# EAGLE design SkyKontrol-IotController (EAGLE 9.5.2)
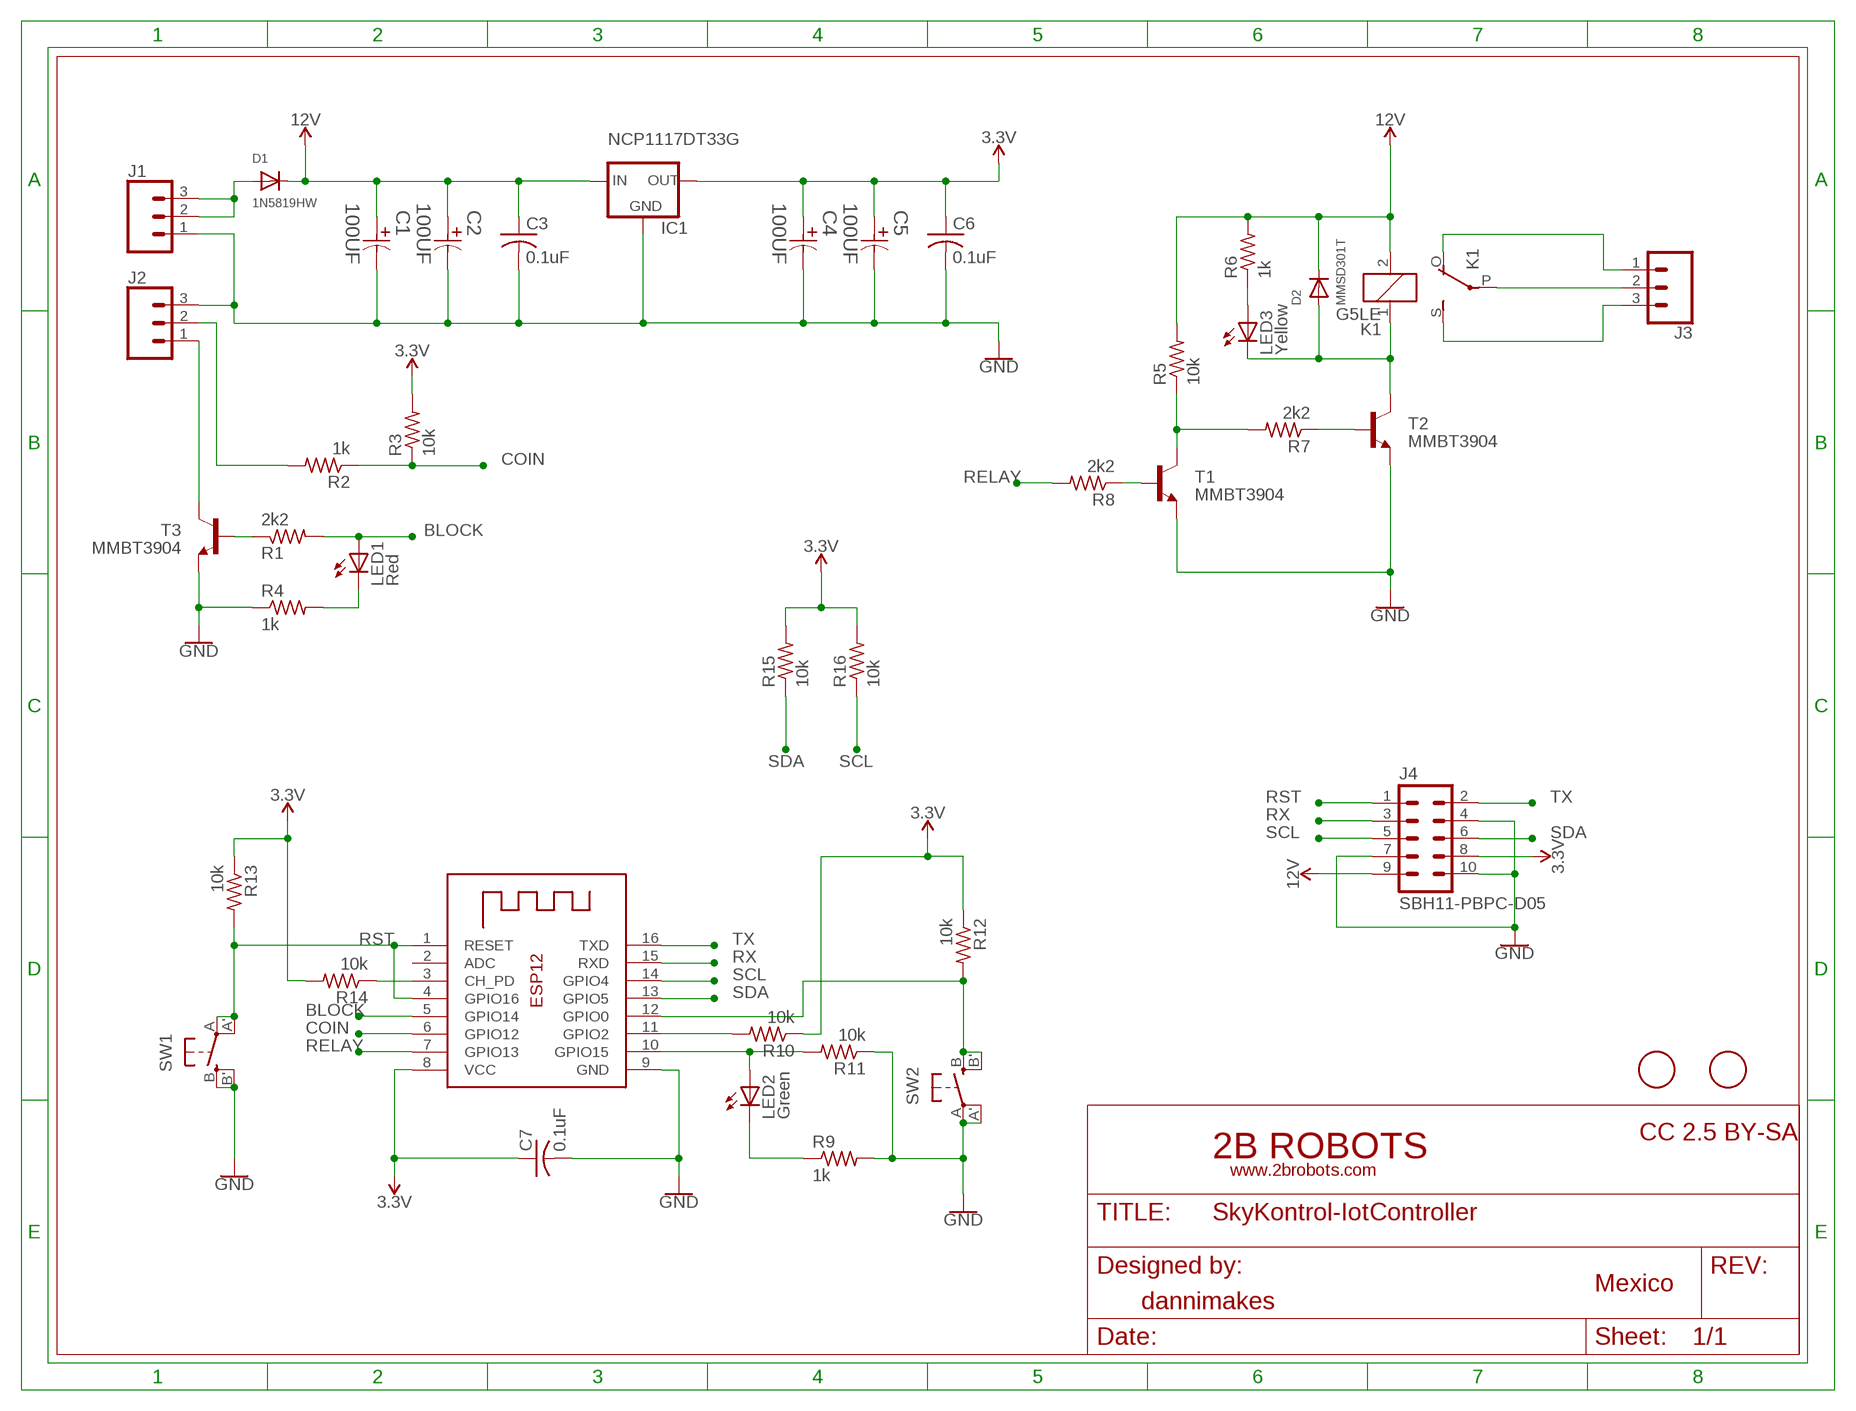
[diagram p0: schematic, sheet 1]

## Parts
C1  100UF  EEE-HA1E101XP-CASE-D8  [CAPAE660X800N]
C2  100UF  EEE-HA1E101XP-CASE-D8  [CAPAE660X800N]
C3  0.1uF  C-USC0603K  [C0603K]
C4  100UF  EEE-HA1E101XP-CASE-D8  [CAPAE660X800N]
C5  100UF  EEE-HA1E101XP-CASE-D8  [CAPAE660X800N]
C6  0.1uF  C-USC0603K  [C0603K]
C7  0.1uF  C-USC0603K  [C0603K]
D1  1N5819HW  DIODESOD-123  [SOD-123]
D2  MMSD301T  DIODESOD-123  [SOD-123]
IC1  NCP1117DT33G  LM1117TO252  [TO252]
J1  CONN_03-SCREW-5MM  [SCREWTERMINAL-5MM-3]
J2  CONN_03-SCREW-5MM  [SCREWTERMINAL-5MM-3]
J3  CONN_03-SCREW-5MM  [SCREWTERMINAL-5MM-3]
J4  SBH11-PBPC-D05  [SBH11-PBPC-D05]
K1  G5LE  [G5LE]
LED1  Red  LEDCHIPLED_1206  [CHIPLED_1206]
LED2  Green  LEDCHIPLED_1206  [CHIPLED_1206]
LED3  Yellow  LEDCHIPLED_1206  [CHIPLED_1206]
R1  2k2  R-US_R0805  [R0805]
R2  1k  R-US_R0805  [R0805]
R3  10k  R-US_R0805  [R0805]
R4  1k  R-US_R0805  [R0805]
R5  10k  R-US_R0805  [R0805]
R6  1k  R-US_R0805  [R0805]
R7  2k2  R-US_R0805  [R0805]
R8  2k2  R-US_R0805  [R0805]
R9  1k  R-US_R0805  [R0805]
R10  10k  R-US_R0805  [R0805]
R11  10k  R-US_R0805  [R0805]
R12  10k  R-US_R0805  [R0805]
R13  10k  R-US_R0805  [R0805]
R14  10k  R-US_R0805  [R0805]
R15  10k  R-US_R0805  [R0805]
R16  10k  R-US_R0805  [R0805]
SW1  SPST_TACT-EVQQ2  [EVQ-Q2]
SW2  SPST_TACT-EVQQ2  [EVQ-Q2]
T1  MMBT3904  MMBT3904LT1-NPN-SOT23-BEC  [SOT23-BEC]
T2  MMBT3904  MMBT3904LT1-NPN-SOT23-BEC  [SOT23-BEC]
T3  MMBT3904  MMBT3904LT1-NPN-SOT23-BEC  [SOT23-BEC]
U$1  FIDUCIAL  [FIDUCIAL_1MM]
U$2  FIDUCIAL  [FIDUCIAL_1MM]
X1  ESP-12  [ESP-12]

## Nets
3.3V: C4.1 C5.1 C6.1 C7.1 IC1.3(OUT) J4.8 R3.2 R10.1 R12.1 R13.1 R14.2 R15.2 R16.2 X1.8(VCC)
12V: C1.1 C2.1 C3.1 D1.C D2.C IC1.2(IN) J4.9 K1.2 R5.2 R6.2
BLOCK: LED1.A R1.2 X1.5(GPIO14)
COIN: R2.1 R3.1 X1.6(GPIO12)
GND: C1.2 C2.2 C3.2 C4.2 C5.2 C6.2 C7.2 IC1.1(GND) J1.1 J2.3 J4.4 J4.7 J4.10 R4.1 R9.2 R11.1 SW1.B'(S1) SW1.B(S) SW2.A'(P1) SW2.A(P) T1.E T2.E T3.E X1.9(GND)
N$1: LED1.C R4.2
N$5: J3.2 K1.P(2:P)
N$6: J2.1 T3.C
N$7: J3.3 K1.S(2:S)
N$8: J3.1 K1.O(2:O)
N$9: D2.A K1.1 LED3.C T2.C
N$12: J2.2 R2.2
N$13: LED3.A R6.1
N$14: R7.1 T2.B
N$15: R5.1 R7.2 T1.C
N$16: R8.1 T1.B
N$17: R1.1 T3.B
N$18: R14.1 X1.3(CH_PD)
N$19: R12.2 SW2.B'(S1) SW2.B(S) X1.12(GPIO0)
N$20: D1.A J1.2 J1.3
N$21: LED2.C R9.1
N$22: LED2.A R11.2 X1.10(GPIO15)
N$23: R10.2 X1.11(GPIO2)
RELAY: R8.2 X1.7(GPIO13)
RST: J4.1 R13.2 SW1.A'(P1) SW1.A(P) X1.1(RESET) X1.4(GPIO16)
RX: J4.3 X1.15(RXD)
SCL: J4.5 R16.1 X1.14(GPIO4)
SDA: J4.6 R15.1 X1.13(GPIO5)
TX: J4.2 X1.16(TXD)
Unconnected: X1.2(ADC)

## Library data of the parts
C1 C2 C4 C5 = Panasonic-EEEFT_EEEH:EEE-: Aluminum Electrolytic Capacitors,Surface Mount Type; MPN: EEE-HA1E101XP; OC_FARNELL: 1973328; OC_NEWARK: 58T9236; PACKAGE: CASE-D8; SUPPLIER: PANASONIC; TOLERANCE: ±20 %; VOLTAGERATING: 25V
C3 C6 C7 = adafruit:C-US: CAPACITOR, American symbol
D1 D2 = adafruit:DIODE: Diode SMADIODE - SMA Surface Mount Package 20V 1A Schottky Diode Digikey: 641-1014-6-ND DO-1N4148 - Through Hole Small Current Diode SOD-123 20V 1 A (.5mV Vf) Schottky Diode - Digikey: MBRX120TPMSCT-ND SOD-323 10V 570mA (.38mV Vf, 3ns) Schottky Diode - Digikey: ZLLS410CT-ND SOD-523 30V 30mA Schottky Diode (RB751S-40TE61) - Digikey: RB751S-40TE61CT-ND SOT23-R/W - SOT23 Package (R = Solder Paste/Reflow Ovens, W = Hand-Soldering) BAT54Film 40V 300mA - Digikey: 497-7162-1-ND
IC1 = v-reg-3:LM1117
J1-J3 = SparkFun-Connectors:CONN_03: Multi connection point. Often used as Generic Header-pin footprint for 0.1 inch spaced/style header connections On any of the 0.1 inch spaced packages, you can populate with these: Break Away Headers - Straight <https://www.sparkfun.com/products/116> (PRT-00116) Break Away Male Headers - Right Angle <https://www.sparkfun.com/products/553> (PRT-00553) Female Headers <https://www.sparkfun.com/products/115> (PRT-00115) Break Away Headers - Machine Pin <https://www.sparkfun.com/products/117> (PRT-00117) Break Away Female Headers - Swiss Machine Pin <https://www.sparkfun.com/products/743> (PRT-00743) Stackable Header - 3 Pin (Female, 0.1") <https://www.sparkfun.com/products/13875> (PRT-13875) For SCREWTERMINALS and SPRING TERMINALS visit here: Screw Terimnals on SparkFun.com <https://www.sparkfun.com/search/results?term=Screw+Terminals> (5mm/3.5mm/2.54mm spacing) This device is also useful as a general connection point to wire up your design to another part of your project. Our various solder wires solder well into these plated through hole pads. Hook-Up Wire - Assortment (Stranded, 22 AWG) <https://www.sparkfun.com/products/11375> (PRT-11375) Hook-Up Wire - Assortment (Solid Core, 22 AWG) <https://www.sparkfun.com/products/11367> (PRT-11367) View the entire wire category on our website here <https://www.sparkfun.com/categories/141> Special notes: Molex polarized connector foot print use with SKU : PRT-08232 with associated crimp pins and housings.; PROD_ID: CONN-10134; SF_SKU: PRT-08433
J4 = con-sullins:SBH11-PBPC-D05: HEADER - Vertical, Shrouded
K1 = relay:G5LE: RELAY 1 x switch, 10 A/120 V AC, 8 A/30 V DC, Omron; OC_FARNELL: unknown; OC_NEWARK: unknown
LED1-LED3 = adafruit:LED: LED OSRAM: - CHIPLED LG R971, LG N971, LY N971, LG Q971, LY Q971, LO R971, LY R971 LH N974, LH R974 LS Q976, LO Q976, LY Q976 LO Q996 - Hyper CHIPLED LW Q18S LB Q993, LB Q99A, LB R99A - SideLED LS A670, LO A670, LY A670, LG A670, LP A670 LB A673, LV A673, LT A673, LW A673 LH A674 LY A675 LS A676, LA A676, LO A676, LY A676, LW A676 LS A679, LY A679, LG A679 - Hyper Micro SIDELED® LS Y876, LA Y876, LO Y876, LY Y876 LT Y87S - SmartLED LW L88C, LW L88S LB L89C, LB L89S, LG L890 LS L89K, LO L89K, LY L89K LS L896, LA L896, LO L896, LY L896 - TOPLED LS T670, LO T670, LY T670, LG T670, LP T670 LSG T670, LSP T670, LSY T670, LOP T670, LYG T670 LG T671, LOG T671, LSG T671 LB T673, LV T673, LT T673, LW T673 LH T674 LS T676, LA T676, LO T676, LY T676, LB T676, LH T676, LSB T676, LW T676 LB T67C, LV T67C, LT T67C, LS T67K, LO T67K, LY T67K, LW E67C LS E67B, LA E67B, LO E67B, LY E67B, LB E67C, LV E67C, LT E67C LW T67C LS T679, LY T679, LG T679 LS T770, LO T770, LY T770, LG T770, LP T770 LB T773, LV T773, LT T773, LW T773 LH T774 LS E675, LA E675, LY E675, LS T675 LS T776, LA T776, LO T776, LY T776, LB T776 LHGB T686 LT T68C, LB T68C - Hyper Mini TOPLED® LB M676 - Mini TOPLED Santana® LG M470 LS M47K, LO M47K, LY M47K Source: http://www.osram.convergy.de/
R1-R16 = adafruit:R-US_: RESISTOR, American symbol
SW1 SW2 = adafruit:SPST_TACT: SMT 6mm switch, EVQQ2 series http://www.ladyada.net/library/eagle
T1-T3 = transistor:*-NPN-: NPN Transistror BF959 corrected 2008.03.06
U$1 U$2 = adafruit:FIDUCIAL: For use by pick and place machines to calibrate the vision/machine, 1mm By microbuilder.eu
X1 = adafruit:ESP-12

## Board
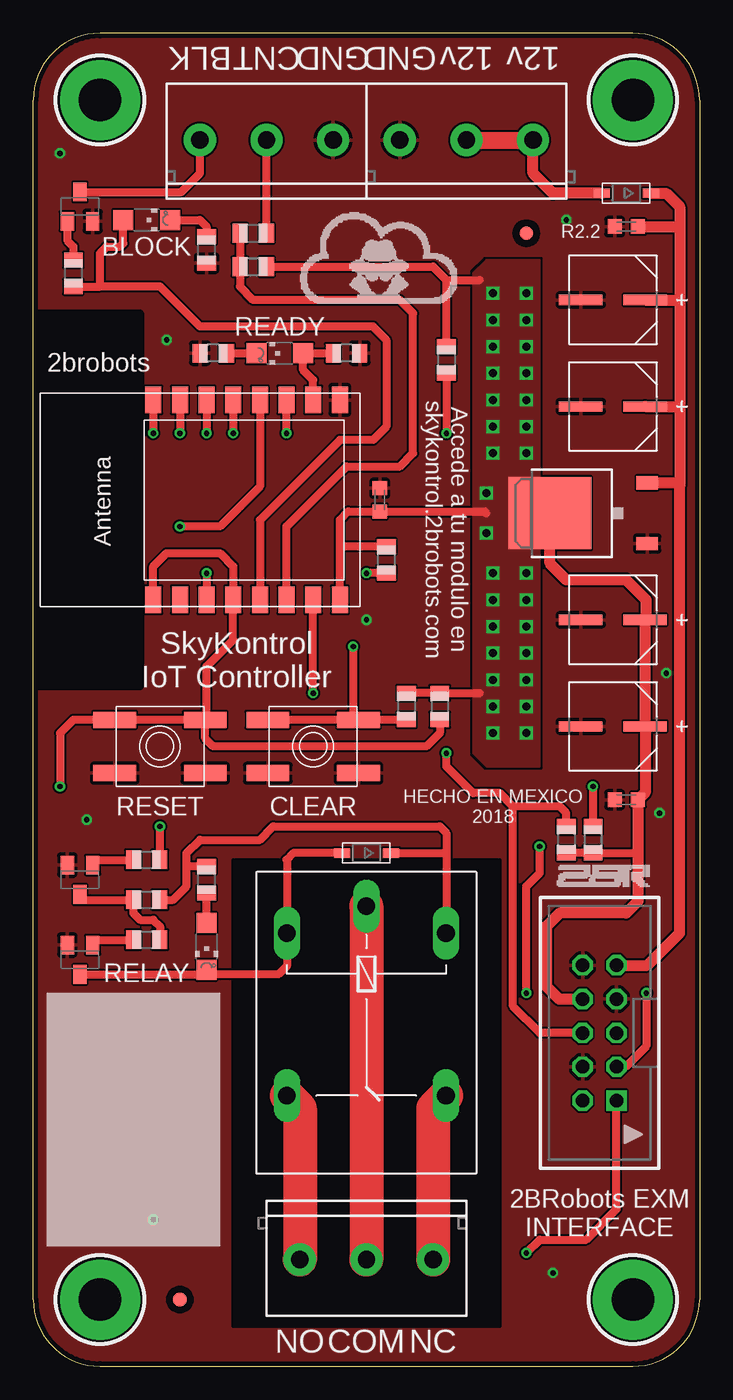
[diagram p1: board, top side]
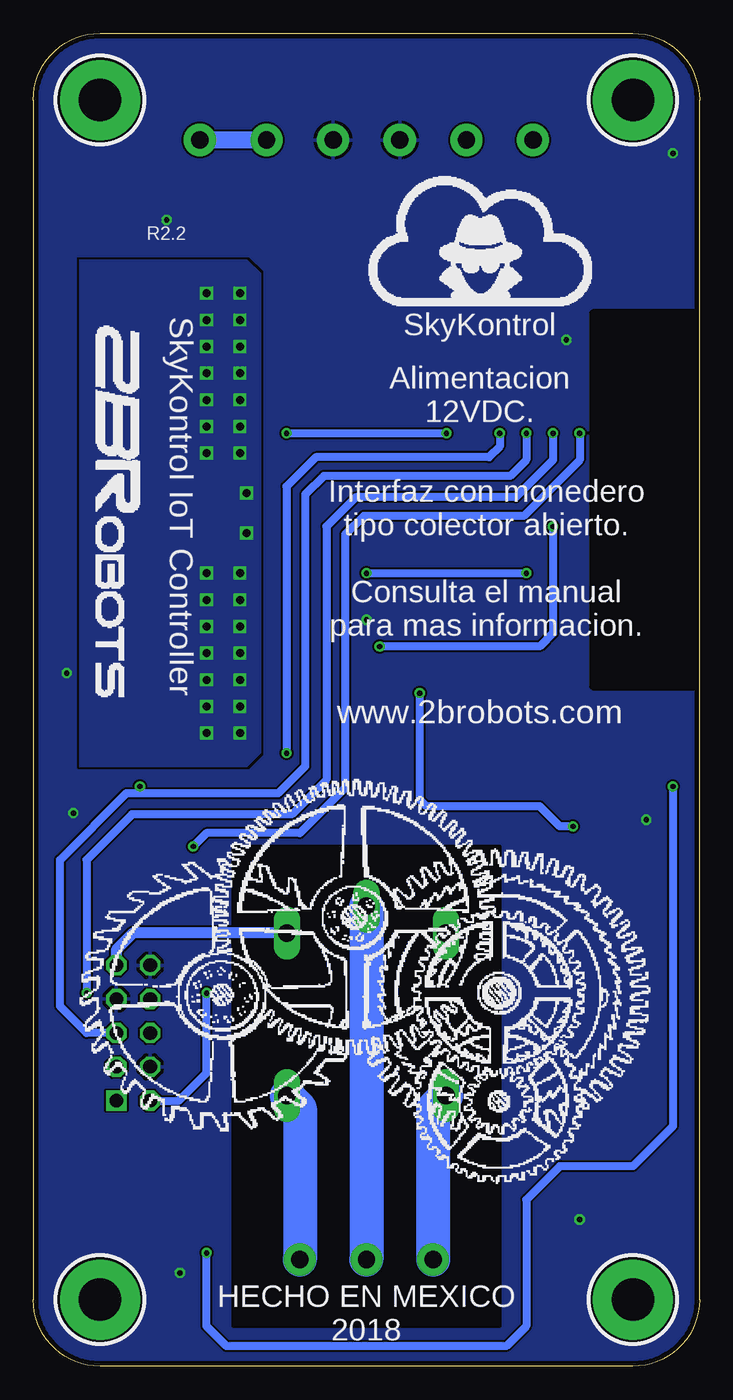
[diagram p2: board, bottom side, seen from below]

Size 50 x 100 mm. Coordinates in mm from the lower left corner, seen from the top.
Outline: 5,0 45,0 arc90 50,5 50,95 arc90 45,100 5,100 arc90 0,95 0,5 arc90 5,0
Copper layers (1*16): Top 0.0356mm / dielectric 1.5011mm / Bottom 0.0356mm
Design rules "2brobots-2layer": minimum track width 6mil, minimum drill 0.3mm, track to track 6mil, track to pad 6mil, pad to pad 6mil, via to via 6mil, smd to smd 6mil, copper to edge 15mil, drill to drill 6mil, minimum pad ring 7mil, minimum via ring 7mil, stop-mask expansion 2.5mil, vias tented up to drill 50mil, thermal gap 10mil
tRestrict: area 0,51 to 8,79; area 15,3 to 35,38
bRestrict: area 0,51 to 8,79; area 15,3 to 35,39

### Footprints (pad centres in the part's own frame; a part is rotated, then mirrored left to right if it is on the bottom)
CAPAE660X800N = smd 3.251 x 0.762: 1 -2.413,0; 2 2.413,0
C0603K = smd 1.05 x 1.08: 1 -0.875,0; 2 0.875,0
SOD-123 = smd 1.2 x 0.7: A 1.85,0; C -1.85,0
TO252 = smd 1 x 1.6: 1 -2.28,-6.07; 2 2.28,-6.07 | smd 5.4 x 6.2: 3 0,1.23
SCREWTERMINAL-5MM-3 = drill 1.3 pad 2.413: 1 -5,0; 2 0,0; 3 5,0
SBH11-PBPC-D05 = drill 1.016 square: 1 -5.08,-1.27 | drill 1.016 octagon: 2 -5.08,1.27; 3 -2.54,-1.27; 4 -2.54,1.27; 5 0,-1.27; 6 0,1.27; 7 2.54,-1.27; 8 2.54,1.27; 9 5.08,-1.27; 10 5.08,1.27
G5LE = drill 1.321 long: 1 -7.493,-5.969; 2 -7.493,5.969; O 4.699,5.969; P -9.525,0; S 4.699,-5.969
CHIPLED_1206 = smd 1.5 x 1.5: A 0,-1.75; C 0,1.75
R0805 = smd 1.1 x 1.4: 1 -1,0; 2 1,0
EVQ-Q2 = smd 3.2 x 1.2: A -3.4,-2; A' 3.4,-2; B -3.4,2; B' 3.4,2
SOT23-BEC = smd 1 x 1.4: B -0.95,-1.1; C 0,1.1; E 0.95,-1.1
FIDUCIAL_1MM = smd 1 x 1: 1 0,0
ESP-12 = smd 2 x 1.2: 1 -7.5,4.5; 2 -7.5,2.5; 3 -7.5,0.5; 4 -7.5,-1.5; 5 -7.5,-3.5; 6 -7.5,-5.5; 7 -7.5,-7.5; 8 -7.5,-9.5; 9 7.5,-9.5; 10 7.5,-7.5; 11 7.5,-5.5; 12 7.5,-3.5; 13 7.5,-1.5; 14 7.5,0.5; 15 7.5,2.5; 16 7.5,4.5

### Placement (x,y rotation side)
C1  43.5,80 180 top
C2  43.5,72 180 top
C3  44.5,85.5 180 top
C4  43.5,56 180 top
C5  43.5,48 180 top
C6  44.5,42.5 180 top
C7  26,65 90 top
D1  44.5,88 180 top
D2  25,38.5 180 top
IC1  40,64 90 top
J1  32.5,92 0 top
J2  17.5,92 0 top
J3  25,8 180 top
J4  42.5,25 90 top
K1  25,25 270 top
LED1  8.5,86 270 top
LED2  18.5,76 90 top
LED3  13,31.5 180 top
R1  3,82 270 top
R2  16.5,85 0 top
R3  16.5,82.5 0 top
R4  13,83.75 90 top
R5  8.5,35 0 top
R6  13,36.5 90 top
R7  8.5,32 0 top
R8  8.5,38 0 top
R9  13.5,76 180 top
R10  31,75.5 270 top
R11  23.5,76 180 top
R12  28,49.5 270 top
R13  30.5,49.5 270 top
R14  26.5,60.5 90 top
R15  40,39.5 270 top
R16  42,39.5 270 top
SW1  9.5,46.5 180 top
SW2  21,46.5 0 top
T1  3.5,36.5 180 top
T2  3.5,30.5 180 top
T3  3.5,87 0 top
U$1  11,5 0 top
U$2  37,85 0 top
X1  13.5,65 90 top

### Tracks (layer width: path | path; a pad name or v marks a point on that pad's centre or on a via)
3.3V  (via drill 0.6)
  Top 0.61: C5.1 46,47.91 | C4.1 46,56.09 | X1.8 23,61.5 | 23,61.5 23,63.5 23.62,64.12 C7.1 33.88,64.12 34,64 | 31,81.5 30,82.5 R3.2 | 31,81.5 33.5,81.5 | R10.1 31,81.5 | R14.2 23,61.5 | R12.1 R13.1 33.5,50.5 | R15.2 R16.2 45.38,38.5
  Top 0.813: C4.1 C5.1 45.91,43.04 C6.1 45.38,38.5 45.38,34.88 44.5,34 39.5,34 38.5,33 38.5,28.5 39.46,27.54 J4.8 | 46,56.09 46,57.5 44.5,59 40,59 38.77,60.23 IC1.3
  other vias: 34.5,59.5 37,59.5 34.5,57.5 37,57.5 34.5,55.5 37,55.5 34.5,53.5 37,53.5 34.5,51.5 37,51.5 34.5,49.5 37,49.5 34.5,47.5 37,47.5 34.5,80.5 37,80.5 34.5,78.5 37,78.5 34.5,76.5 37,76.5 34.5,74.5 37,74.5 34.5,72.5 37,72.5 34.5,70.5 37,70.5 34.5,68.5 37,68.5 34,62.5 34,65.5
  pour Top (isolate 0.406, no thermals): 38,45 38,83 34,83 33,82 33,46 34,45
  pour Bottom (isolate 0.406, no thermals): 46.5,83 34,83 33,82 33,46 34,45 46.5,45
12V
  Top 0.61: 48.22,66.28 48.5,66 | R5.2 10.5,35 11.5,36 11.5,37.5 | 11.5,37.5 11.5,38.5 12.5,39.5 17,39.5 18,40.5 30.5,40.5 31,40 31,38.5 | 31,38.5 31,32.52 K1.2 | D2.C 31,38.5 | R6.2 11.5,37.5
  Top 0.813: D1.C 47.5,88 48.5,87 48.5,85.5 | 48.5,85.5 48.5,80 | 48.5,80 48.5,72 | 48.5,72 48.5,66 48.5,32.5 46.08,30.08 J4.9 | C3.1 48.5,85.5 | C1.1 48.5,80 | C2.1 48.5,72 | IC1.2 48.22,66.28
  Bottom 0.813: K1.2 42.51,32.49 43.77,31.23 J4.9
BLOCK
  Top 0.61: R1.2 5,81 | 5,81 5,83.5 5.5,84 6.5,84 6.75,84.25 LED1.A | X1.5 17,63.5 23,69.5 25.5,69.5 26.5,70.5 26.5,77 25.5,78 12.5,78 9.5,81 5,81
COIN
  Top 0.61: R2.1 R3.1 15.5,81 16.5,80 27.5,80 28.5,79 28.5,68.5 27.5,67.5 23.5,67.5 19,63 X1.6
GND  (via drill 0.4)
  other vias: 47,41.5 47.5,52 4,41 9,11 39,7 40,86 2,91 25,56 10,77
  pour Top (rank 2): 0,100 50,100 50,0 0,0
  pour Bottom (rank 2): 0,100 50,100 50,0 0,0
N$1
  Top 0.61: LED1.C 12.5,86 13,85.5 R4.2
N$2  (via drill 3.2 pad 6)
  other vias: 5,95
N$4  (via drill 3.2 pad 6)
  other vias: 45,95
N$5
  Top 2.54: K1.P J3.2
  Bottom 2.54: K1.P J3.2
N$6
  Top 0.61: T3.C 11.1,88.1 12.5,89.5 J2.1
N$7
  Top 2.54: K1.S 20,19.33 J3.3
  Bottom 2.54: K1.S 20,19.33 J3.3
N$8
  Top 2.54: K1.O 30,19.33 J3.1
  Bottom 2.54: K1.O 30,19.33 J3.1
N$9
  Top 0.61: D2.A 19.5,38.5 19,38 19.03,37.97 K1.1 19.03,30.03 18.4,29.4 12.65,29.4 | T2.C 12.65,29.4 | 12.65,29.4 LED3.C
N$10  (via drill 3.2 pad 6)
  other vias: 5,5
N$11  (via drill 3.2 pad 6)
  other vias: 45,5
N$12
  Top 0.61: R2.2 J2.2
N$13
  Top 0.61: LED3.A R6.1
N$14
  Top 0.61: T2.B 4.85,32 R7.1
N$15
  Top 0.61: T1.C 3.9,35 R5.1 7.5,34 8,33.5 9,33.5 9.5,33 R7.2
N$16
  Top 0.61: T1.B 4.85,38 R8.1
N$17
  Top 0.61: T3.B 2.55,84.45 3,84 R1.1
N$18  (via drill 0.4)
  Top 0.61: R14.1 v25,59.5 | v13,59.5 X1.3
  Bottom 0.61: v25,59.5 v13,59.5
N$19  (via drill 0.4)
  Top 0.61: 24,48.5 SW2.B' R12.2 | 24,48.5 SW2.B | X1.12 17,66 14,63 v11,63 | v24,54 24,48.5
  Bottom 0.61: v24,54 12,54 11,55 v11,63
N$20
  Top 0.813: D1.A 39,88 37.5,89.5 J1.3
  Top 1.27: J1.2 J1.3
  Bottom 1.27: J1.2 J1.3
N$21
  Top 0.61: R9.1 LED2.C
N$22
  Top 0.61: R11.2 LED2.A 20.25,74.75 21,74 X1.10
N$23  (via drill 0.4)
  Top 0.61: R10.2 v31,70 | v19,70 X1.11
  Bottom 0.61: v31,70 v19,70
RELAY  (via drill 0.4)
  Top 0.61: R8.2 v9.5,40.5 | v21,50.5 X1.7
  Bottom 0.61: v21,50.5 21,42.5 20.5,42 12,42 10.5,40.5 v9.5,40.5
RST  (via drill 0.4)
  Top 0.61: X1.1 9,60 10,61 14,61 15,60 X1.4 15,54.5 13,52.5 13,48.6 SW1.A | SW1.A SW1.A' 3,48.5 2,47.5 v2,43.5 | R13.2 30.5,47.5 29.5,46.5 13.5,46.5 12.9,47.1 SW1.A | J4.1 43.77,11.77 41.5,9.5 38,9.5 v37,8.5
  Bottom 0.61: v2,43.5 2,18 5,15 10.5,15 13,12.5 13,3 14.5,1.5 35.5,1.5 37,3 v37,8.5
RX  (via drill 0.4)
  Top 0.61: X1.15 v11,70 | v46,28 46,24 44.46,22.46 J4.3
  Bottom 0.61: v11,70 11,68 13.8,65.2 25.8,65.2 28,63 28,44 30.6,41.4 42.6,41.4 46,38 v46,28
SCL  (via drill 0.4)
  Top 0.61: X1.14 v13,70 | v42,43.5 R16.1
  Bottom 0.61: v13,70 13,68 14.2,66.8 28.2,66.8 29.6,65.4 29.6,45 31.6,43 42,43 | J4.5 46,25 48,27 48,38 43,43 42,43 | 42,43 v42,43.5
SDA  (via drill 0.4)
  Top 0.61: X1.13 v15,70 | 36,42 35,43 33,43 31,45 v31,46 | J4.6 38,25 36,27 36,42 | R15.1 40,41.5 39.5,42 36,42
  Bottom 0.61: v15,70 15,69 15.8,68.2 28.8,68.2 31,66 v31,46
TX  (via drill 0.4)
  Top 0.61: X1.16 v9,70 | v37,28 37,36 38,37 v38,39
  Bottom 0.61: v9,70 9,68 13.2,63.8 25.2,63.8 26.6,62.4 26.6,43.4 30,40 37,40 v38,39 | J4.2 39.08,19.92 37,22 v37,28

### Text on the board
tPlace: BLK | CNT | GND | GND | 12v | 12v | R2.2 | BLOCK | READY | 2brobots | Accede a tu modulo en / skykontrol.2brobots.com | SkyKontrol / IoT Controller | RESET | CLEAR | HECHO EN MEXICO / 2018 | RELAY | 2BRobots EXM / INTERFACE | NO | COM | NC
bPlace: R2.2 | SkyKontrol | Alimentacion / 12VDC. | Interfaz con monedero / tipo colector abierto. / / Consulta el manual / para mas informacion. | SkyKontrol IoT Controller | www.2brobots.com | HECHO EN MEXICO / 2018